# EasyEDA Pro project sensor-coils-example-5.epro

# Board 2024-06-03_06-25-29
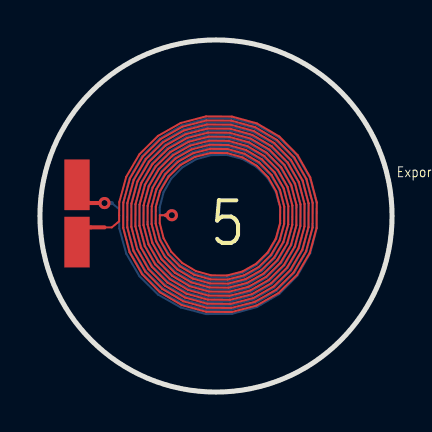
[diagram p0: board, top side]
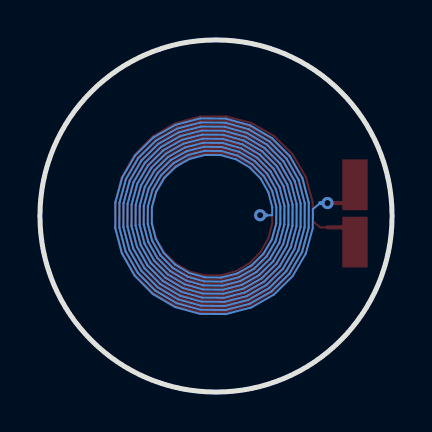
[diagram p1: board, bottom side, seen from below]

Outline 17.63 x 17.63 mm; copper layers: Top Layer, Bottom Layer. Coordinates in mm from the lower left corner of the outline.
Outline path: circle c8.82,8.82 r8.82
Stack: Top Layer 0.035mm - / Dielectric1 1.51mm FR4 er 4.5 / Bottom Layer 0.035mm -

## Design rules (mm)
template: 用户自定义配置
spacing safeClearance (default): track to track 0.152, other pairs 0.152 to 0.3
track width trackWidth (default): min 0.025, default 0.254, max 2.54
differential pair differentialPair (default): width min 0.127, default 0.254, max 2.54; gap min 0.152, default 0.152
via viaSize (default): diameter min 0.5, default 0.61, max 10; hole min 0.3, default 0.305, max 5.999

## Placement (name value [footprint] x y rotation side)
CSENSOR  -  [0402]  1.86 8.94 90 top

## Footprints (pads in the part's own frame, mm; a bottom-side part is the same pattern mirrored in y, then rotated)
0402
  rect 2.54x1.27 smd: 1(-1.435,0) 2(1.435,0)

## Nets
3: CSENSOR.1 CSENSOR.2

## Via types
v1: diameter 0.61, hole 0.305, Top Layer to Bottom Layer, 2 vias

## Routing (per net, layer and track width the routed paths; a pad name or vN(x,y) marks a point on that pad's centre or on a via; arc(x,y) is an arc through that point)
3: length 509.3
  Top Layer w0.102: 3.23,8.25 3.6,8.25 3.97,8.55 3.97,8.86 3.97,9.51 4.32,10.78 4.98,11.91 5.92,12.83 7.05,13.48 8.31,13.8 9.62,13.8 10.87,13.45 11.99,12.8 12.9,11.87 13.54,10.75 13.86,9.5 13.85,8.21 13.51,6.97 12.86,5.86 11.95,4.96 10.84,4.33 9.6,4.01 8.33,4.02 7.1,4.36 6,5 5.11,5.9 4.49,7 4.17,8.22 4.18,9.49 4.51,10.7 5.15,11.79 6.04,12.67 7.13,13.29 8.34,13.6 9.59,13.59 10.79,13.26 11.86,12.63 12.74,11.75 13.35,10.67 13.66,9.47 13.65,8.24 13.32,7.05 12.7,5.99 11.83,5.13 10.76,4.52 9.58,4.21 8.35,4.22 7.18,4.54 6.13,5.16 5.28,6.03 4.68,7.08 4.37,8.25 4.38,9.46 4.7,10.62 5.31,11.66 6.17,12.5 7.21,13.1 8.37,13.4 9.56,13.39 10.71,13.07 11.74,12.47 12.57,11.62 13.16,10.59 13.46,9.45 13.45,8.27 13.13,7.13 12.54,6.11 11.7,5.29 10.68,4.71 9.55,4.42 8.38,4.42 7.26,4.73 6.25,5.32 5.44,6.15 4.87,7.16 4.57,8.28 4.58,9.43 4.89,10.54 5.47,11.54 6.29,12.34 7.29,12.91 8.39,13.2 9.53,13.19 10.63,12.88 11.61,12.31 12.41,11.5 12.97,10.51 13.25,9.42 13.25,8.29 12.95,7.21 12.38,6.24 11.58,5.45 10.6,4.9 9.52,4.62 8.41,4.63 7.34,4.92 6.38,5.49 5.6,6.28 5.06,7.24 4.78,8.31 4.79,9.41 5.08,10.47 5.63,11.41 6.41,12.18 7.37,12.72 8.42,12.99 9.51,12.98 10.56,12.69 11.49,12.14 12.25,11.37 12.78,10.44 13.05,9.39 13.04,8.32 12.76,7.29 12.21,6.36 11.45,5.61 10.53,5.09 9.5,4.82 8.44,4.83 7.41,5.11 6.5,5.65 5.76,6.4 5.25,7.31 4.98,8.33 4.99,9.38 5.27,10.39 5.8,11.29 6.54,12.02 7.44,12.53 8.45,12.79 9.48,12.78 10.48,12.51 11.36,11.98 12.09,11.25 12.59,10.36 12.85,9.37 12.84,8.35 12.57,7.36 12.05,6.49 11.33,5.78 10.45,5.28 9.47,5.03 8.46,5.03 7.49,5.3 6.63,5.81 5.93,6.52 5.43,7.39 5.18,8.36 5.19,9.35 5.46,10.31 5.96,11.16 6.66,11.85 7.52,12.34 8.47,12.59 9.46,12.58 10.4,12.32 11.24,11.82 11.92,11.12 12.4,10.28 12.64,9.34 12.63,8.37 12.38,7.44 11.89,6.61 11.2,5.94 10.37,5.47 9.44,5.23 8.49,5.24 7.57,5.49 6.75,5.97 6.09,6.65 5.62,7.47 5.39,8.39 5.4,9.33 5.65,10.23 6.12,11.04 6.79,11.69 7.6,12.15 8.5,12.38 9.43,12.37 10.32,12.13 11.11,11.66 11.76,11 12.21,10.2 12.44,9.31 12.43,8.4 12.19,7.52 11.73,6.74 11.08,6.1 10.29,5.66 9.42,5.43 8.52,5.44 7.65,5.68 6.88,6.14 6.25,6.77 5.81,7.55 5.59,8.41 5.6,9.3 5.84,10.15 6.29,10.91 6.91,11.53 7.68,11.96 8.53,12.18 9.4,12.17 10.24,11.94 10.99,11.5 11.6,10.88 12.02,10.12 12.24,9.29 12.23,8.43 12,7.6 11.56,6.86 10.95,6.26 10.21,5.85 9.39,5.63 8.54,5.64 7.73,5.87 7,6.3 6.41,6.9 6,7.63 5.79,8.44 5.8,9.27 6.03,10.07 6.45,10.79 7.04,11.37 7.76,11.77 8.55,11.98 9.37,11.97 10.16,11.75 10.87,11.33 11.43,10.75 11.83,10.04 12.03,9.26 12.03,8.45 11.81,7.68 11.4,6.99 10.83,6.43 10.13,6.04 9.36,5.84 8.57,5.85 7.81,6.06 7.13,6.46 6.58,7.02 6.19,7.71 6,8.47 6.01,8.86 6.31,8.86
  Top Layer w0.203: 1.87,8.25 3.23,8.25 ; 1.87,9.64 1.87,9.55 2.55,9.47 v1(3.23,9.47) ; 6.31,8.86 v1(6.61,8.86)
  Bottom Layer w0.102: 6.31,8.86 6.01,8.86 6,9.25 6.19,10 6.58,10.69 7.13,11.25 7.81,11.65 8.57,11.87 9.36,11.87 10.13,11.68 10.83,11.28 11.4,10.73 11.81,10.03 12.03,9.26 12.03,8.45 11.83,7.67 11.43,6.96 10.87,6.38 10.16,5.96 9.37,5.74 8.55,5.74 7.76,5.94 7.04,6.35 6.45,6.92 6.03,7.64 5.8,8.44 5.79,9.27 6,10.08 6.41,10.81 7,11.41 7.73,11.84 8.54,12.07 9.39,12.08 10.21,11.87 10.95,11.45 11.56,10.85 12,10.11 12.23,9.29 12.24,8.42 12.02,7.59 11.6,6.84 10.99,6.22 10.24,5.78 9.4,5.54 8.53,5.53 7.68,5.75 6.91,6.18 6.29,6.8 5.84,7.56 5.6,8.41 5.59,9.3 5.81,10.16 6.25,10.94 6.88,11.58 7.65,12.03 8.52,12.27 9.42,12.28 10.29,12.06 11.08,11.61 11.73,10.97 12.19,10.19 12.43,9.31 12.44,8.4 12.21,7.51 11.76,6.71 11.11,6.05 10.32,5.59 9.43,5.34 8.5,5.33 7.6,5.56 6.79,6.02 6.12,6.67 5.65,7.48 5.4,8.39 5.39,9.33 5.62,10.24 6.09,11.06 6.75,11.74 7.57,12.22 8.49,12.48 9.44,12.48 10.37,12.24 11.2,11.77 11.89,11.1 12.38,10.27 12.63,9.34 12.64,8.37 12.4,7.43 11.92,6.59 11.24,5.89 10.4,5.4 9.46,5.14 8.47,5.13 7.52,5.37 6.66,5.86 5.96,6.55 5.46,7.4 5.19,8.36 5.18,9.35 5.43,10.32 5.93,11.19 6.63,11.9 7.49,12.41 8.46,12.68 9.47,12.69 10.45,12.43 11.33,11.94 12.05,11.22 12.57,10.35 12.84,9.37 12.85,8.34 12.59,7.35 12.09,6.46 11.36,5.73 10.48,5.21 9.48,4.93 8.45,4.92 7.44,5.18 6.54,5.7 5.8,6.43 5.27,7.33 4.99,8.33 4.98,9.38 5.25,10.4 5.76,11.31 6.5,12.06 7.41,12.6 8.44,12.88 9.5,12.89 10.53,12.62 11.45,12.1 12.21,11.35 12.76,10.43 13.04,9.39 13.05,8.32 12.78,7.28 12.25,6.34 11.49,5.57 10.56,5.02 9.51,4.73 8.42,4.72 7.37,4.99 6.41,5.53 5.63,6.3 5.08,7.25 4.79,8.31 4.78,9.41 5.06,10.48 5.6,11.44 6.38,12.23 7.34,12.79 8.41,13.09 9.52,13.09 10.6,12.81 11.58,12.26 12.38,11.47 12.95,10.5 13.25,9.42 13.25,8.29 12.97,7.2 12.41,6.21 11.61,5.4 10.63,4.83 9.53,4.53 8.39,4.52 7.29,4.8 6.29,5.37 5.47,6.18 4.89,7.17 4.58,8.28 4.57,9.43 4.87,10.55 5.44,11.56 6.25,12.39 7.26,12.98 8.38,13.29 9.55,13.3 10.68,13 11.7,12.42 12.54,11.6 13.13,10.58 13.45,9.45 13.46,8.26 13.16,7.12 12.57,6.09 11.74,5.24 10.71,4.64 9.56,4.32 8.37,4.31 7.21,4.62 6.17,5.21 5.31,6.05 4.7,7.09 4.38,8.25 4.37,9.46 4.68,10.63 5.28,11.69 6.13,12.55 7.18,13.17 8.35,13.49 9.58,13.5 10.76,13.19 11.83,12.59 12.7,11.72 13.32,10.66 13.65,9.47 13.66,8.24 13.35,7.04 12.74,5.96 11.86,5.08 10.79,4.45 9.59,4.12 8.34,4.11 7.13,4.43 6.04,5.05 5.15,5.93 4.51,7.01 4.18,8.23 4.17,9.49 4.49,10.71 5.11,11.81 6,12.71 7.1,13.36 8.33,13.69 9.6,13.7 10.84,13.38 11.95,12.75 12.86,11.85 13.51,10.74 13.85,9.5 13.86,8.21 13.54,6.96 12.9,5.84 11.99,4.92 10.87,4.26 9.62,3.92 8.31,3.91 7.05,4.24 5.92,4.88 4.98,5.8 4.32,6.93 3.97,8.2 3.97,8.86 3.97,9.16 3.6,9.47
  Bottom Layer w0.203: 6.31,8.86 v1(6.61,8.86) ; 3.6,9.47 v1(3.23,9.47)

## Text on the board
Top Silkscreen Layer: Layers = 2 | Turns = 10 | Version - 1.1 | -------------- | Design Id - 107 | Coil Parameters | Customized for LDC1612 | Trace Width = 4.0 mils | Layer Stack Information | Trace Spacing = 4.0 mils | ------------------------- | WEBENCH Design Information | Copper thickness = 1.0 Oz-Cu | Exported on - 2024/06/03 06:25:27 | Inner Diameter = 234 mils (Approx.) | Outer Diameter = 394 mils (Approx.) | Space between TOP and BOTTOM = 4.0 mils | Exported from WEBENCH Coil Designer Tool | 5
